# Altium project DC-DC_Filter.PrjPcb
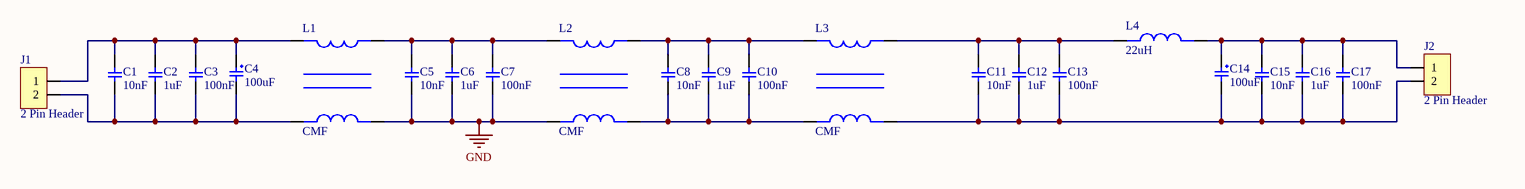
[diagram p0: DC-DC Filter Schematic.SchDoc]
1 sheet, 23 parts. Net scope: global (net labels, ports and power ports of the same name join across sheets).
Board file: DC-DC-Filter PCB.PcbDoc

## Sheet DC-DC Filter Schematic.SchDoc
size A4

### Parts
C1  10nF  [CAP805]
C2  1uF  [CAP805]
C3  100nF  [CAP805]
C4  100uF  [V-CHIP CAP]
C5  10nF  [CAP805]
C6  1uF  [CAP805]
C7  100nF  [CAP805]
C8  10nF  [CAP805]
C9  1uF  [CAP805]
C10  100nF  [CAP805]
C11  10nF  [CAP805]
C12  1uF  [CAP805]
C13  100nF  [CAP805]
C14  100uF  [V-CHIP CAP]
C15  10nF  [CAP805]
C16  1uF  [CAP805]
C17  100nF  [CAP805]
J1  2 Pin Header  [2POS_5.08mm_Terminal]
J2  2 Pin Header  [2POS_5.08mm_Terminal]
L1  CMF  [CMF]
L2  CMF  [CMF]
L3  CMF  [CMF]
L4  22uH  [Inductor]

### Nets
GND: C5.1 C6.1 C7.1 L1.3 L2.2
NetC1_1: C1.1 C2.1 C3.1 C4.2 J1.2 L1.2
NetC1_2: C1.2 C2.2 C3.2 C4.1 J1.1 L1.1
NetC5_2: C5.2 C6.2 C7.2 L1.4 L2.1
NetC8_1: C8.1 C9.1 C10.1 L2.3 L3.2
NetC8_2: C8.2 C9.2 C10.2 L2.4 L3.1
NetC11_1: C11.1 C12.1 C13.1 C14.2 C15.1 C16.1 C17.1 J2.2 L3.3
NetC11_2: C11.2 C12.2 C13.2 L3.4 L4.1
NetC14_1: C14.1 C15.2 C16.2 C17.2 J2.1 L4.2

### Library data of the parts
C1-C3 C5-C13 C15-C17 = Capacitor
C4 C14 = Cap pol
L4 = Inductor